# EAGLE schematic basic_micro (EAGLE 6.5.0)
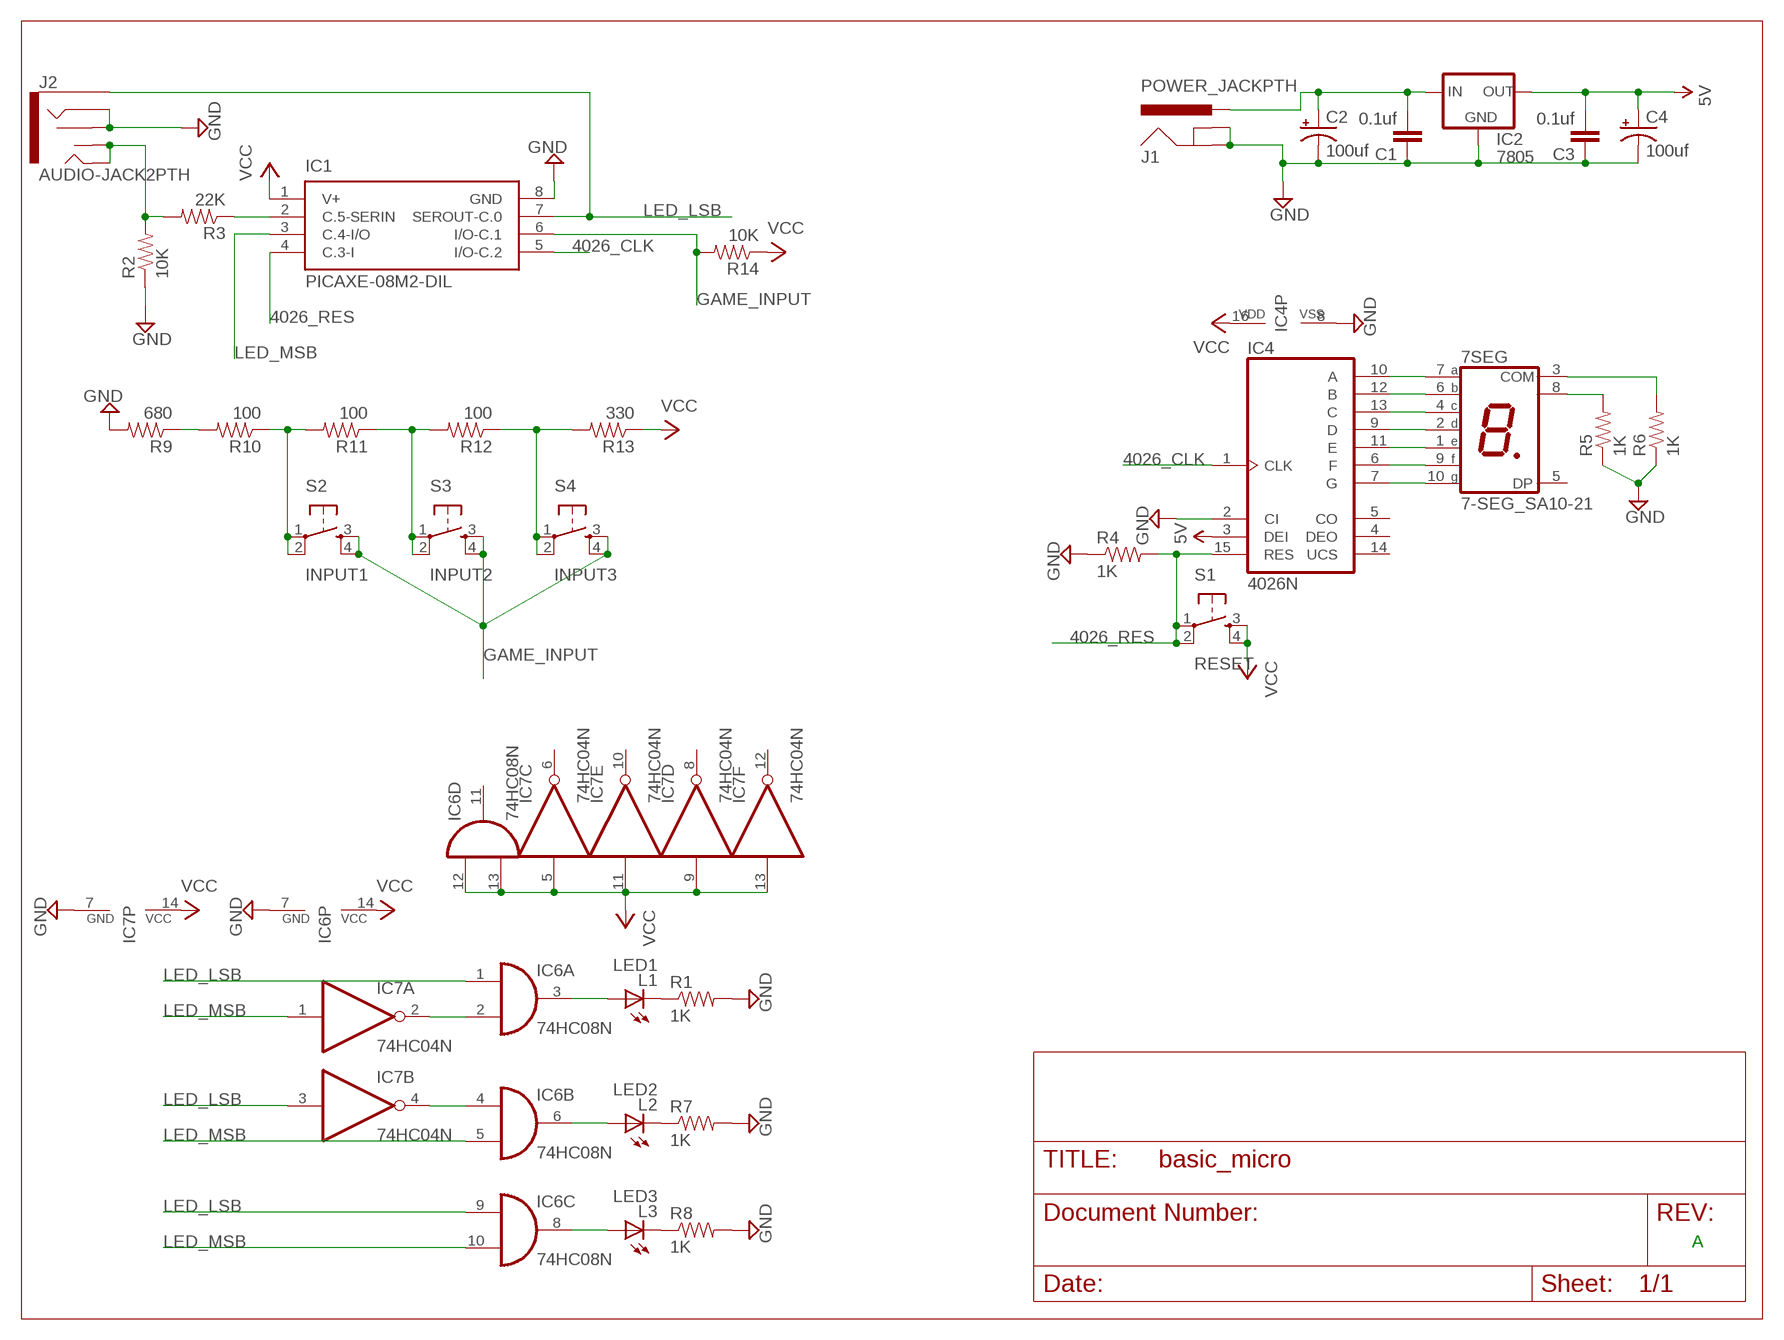
[diagram p0: schematic, sheet 1]

## Parts
7SEG  7-SEG_SA10-21  [SA10-21]
C1  0.1uf  C-EU025-025X050  [C025-025X050]
C2  100uf  CPOL-USETR3  [ETR3]
C3  0.1uf  C-EU025-025X050  [C025-025X050]
C4  100uf  CPOL-USETR3  [ETR3]
IC1  PICAXE-08M2-DIL  [DIL8]
IC2  7805  78XXL  [78XXL]
IC4  4026N  [DIL16]
IC6  74HC08N  [DIL14]
IC7  74HC04N  [DIL14]
J1  POWER_JACKPTH  [POWER_JACK_PTH]
J2  AUDIO-JACK2PTH  [AUDIO-JACK]
L1  LED1  LED3MM  [LED3MM]
L2  LED2  LED3MM  [LED3MM]
L3  LED3  LED3MM  [LED3MM]
R1  1K  RESISTORPTH-1/4W  [AXIAL-0.4]
R2  10K  RESISTORPTH-1/4W  [AXIAL-0.4]
R3  22K  RESISTORPTH-1/4W  [AXIAL-0.4]
R4  1K  RESISTORPTH-1/4W  [AXIAL-0.4]
R5  1K  RESISTORPTH-1/4W  [AXIAL-0.4]
R6  1K  RESISTORPTH-1/4W  [AXIAL-0.4]
R7  1K  RESISTORPTH-1/4W  [AXIAL-0.4]
R8  1K  RESISTORPTH-1/4W  [AXIAL-0.4]
R9  680  RESISTORPTH-1/4W  [AXIAL-0.4]
R10  100  RESISTORPTH-1/4W  [AXIAL-0.4]
R11  100  RESISTORPTH-1/4W  [AXIAL-0.4]
R12  100  RESISTORPTH-1/4W  [AXIAL-0.4]
R13  330  RESISTORPTH-1/4W  [AXIAL-0.4]
R14  10K  RESISTORPTH-1/4W  [AXIAL-0.4]
S1  RESET  TAC_SWITCHPTH  [TACTILE-PTH]
S2  INPUT1  TAC_SWITCHPTH  [TACTILE-PTH]
S3  INPUT2  TAC_SWITCHPTH  [TACTILE-PTH]
S4  INPUT3  TAC_SWITCHPTH  [TACTILE-PTH]

## Nets
5V: C3.2 C4.+ IC2.OUT IC4.3(DEI)
4026_CLK: IC1.5(I/O-C.2) IC4.1(CLK)
4026_RES: IC1.4(C.3-I) IC4.15(RES) R4.P$2 S1.1 S1.2
GAME_INPUT: IC1.6(I/O-C.1) R14.P$2 S2.3 S2.4 S3.3 S3.4 S4.3 S4.4
GND: C1.1 C2.- C3.1 C4.- IC1.8(GND) IC2.GND IC4.2(CI) IC4.8(VSS) IC6.7(P:GND) IC7.7(P:GND) J1.GND J1.GNDBREAK J2.RING J2.RSH R1.P$2 R2.P$1 R4.P$1 R5.P$1 R6.P$1 R7.P$2 R8.P$2 R9.P$2
LED_LSB: IC1.7(SEROUT-C.0) IC6.1(A:I0) IC6.9(C:I0) IC7.3(B:I) J2.SLEEVE
LED_MSB: IC1.3(C.4-I/O) IC6.5(B:I1) IC6.10(C:I1) IC7.1(A:I)
N$1: IC1.2(C.5-SERIN) R3.P$1
N$2: 7SEG.3(COM) R6.P$2
N$3: C1.2 C2.+ IC2.IN J1.PWR
N$4: 7SEG.8(COM) R5.P$2
N$6: R9.P$1 R10.P$2
N$8: R10.P$1 R11.P$2 S2.1 S2.2
N$9: R11.P$1 R12.P$2 S3.1 S3.2
N$10: J2.TIP J2.TSH R2.P$2 R3.P$2
N$13: 7SEG.9(F) IC4.6(F)
N$14: 7SEG.2(D) IC4.9(D)
N$15: 7SEG.6(B) IC4.12(B)
N$16: 7SEG.7(A) IC4.10(A)
N$17: 7SEG.4(C) IC4.13(C)
N$18: 7SEG.1(E) IC4.11(E)
N$19: 7SEG.10(G) IC4.7(G)
N$20: IC6.4(B:I0) IC7.4(B:O)
N$21: IC6.2(A:I1) IC7.2(A:O)
N$22: L1.K(C) R1.P$1
N$23: L2.K(C) R7.P$1
N$24: L3.K(C) R8.P$1
N$25: IC6.8(C:O) L3.A
N$26: IC6.6(B:O) L2.A
N$27: IC6.3(A:O) L1.A
N$28: R12.P$1 R13.P$2 S4.1 S4.2
VCC: IC1.1(V+) IC4.16(VDD) IC6.12(D:I0) IC6.13(D:I1) IC6.14(P:VCC) IC7.5(C:I) IC7.9(D:I) IC7.11(E:I) IC7.13(F:I) IC7.14(P:VCC) R13.P$1 R14.P$1 S1.3 S1.4
Unconnected: 7SEG.5(DP) IC4.4(DEO) IC4.5(CO) IC4.14(UCS) IC6.11(D:O) IC7.6(C:O) IC7.8(D:O) IC7.10(E:O) IC7.12(F:O)

## Notes on the sheet
- A

## Library data of the parts
7SEG = display-kingbright:7-SEG_: Kingbright 14.2mm (0.56 INCH) SINGLE DIGIT NUMERIC DUISPLAY Source: SA56-11EWA(Ver1189471036.pdf; OC_FARNELL: unknown; OC_NEWARK: unknown
C1 C3 = rcl:C-EU: CAPACITOR, European symbol
C2 C4 = rcl:CPOL-US: POLARIZED CAPACITOR, American symbol
IC1 = PICAXE:PICAXE-08M2
IC2 = v-reg:78XXL: VOLTAGE REGULATOR
IC4 = 40xx:4026: Decade COUNTER/DIVIDER, 7-seg. outputs
IC6 = 74xx-eu:74*08: Quad 2-input AND gate
IC7 = 74xx-eu:74*04: Hex INVERTER
J1 = SparkFun-Connectors:POWER_JACK: Power Jack This is the standard 5.5mm barrel jack for power. The PTH is the most common, proven, reliable, footprint. The Slot footprint only works if the mill layer is transmitted to the PCB fab house so be warned. Spark Fun Electronics SKU : PRT-00119 SMT: CONN-08106 Mating wall wart : TOL-00298 (and others)
J2 = SparkFun-Connectors:AUDIO-JACK2: Stereo audio jack with bypass switches. SMT version used on LilyPad MP3 board.; PROD_ID: CONN-08774
L1-L3 = SparkFun-LED:LED: LEDs Standard schematic elements and footprints for 5mm, 3mm, 1206, and 0603 sized LEDs. 5mm - Spark Fun Electronics SKU : COM-00529 (and others)
R1-R14 = SparkFun-Passives:RESISTOR: Resistor Basic schematic elements and footprints for 0603, 1206, and PTH resistors.
S1-S4 = SparkFun-Electromechanical:TAC_SWITCH: Momentary Switch Button commonly used for reset or general input. Spark Fun Electronics SKU : COM-00097 SMT- SWCH-08247